# EAGLE schematic RPI_HAT_CDJ (EAGLE 8.2.2)
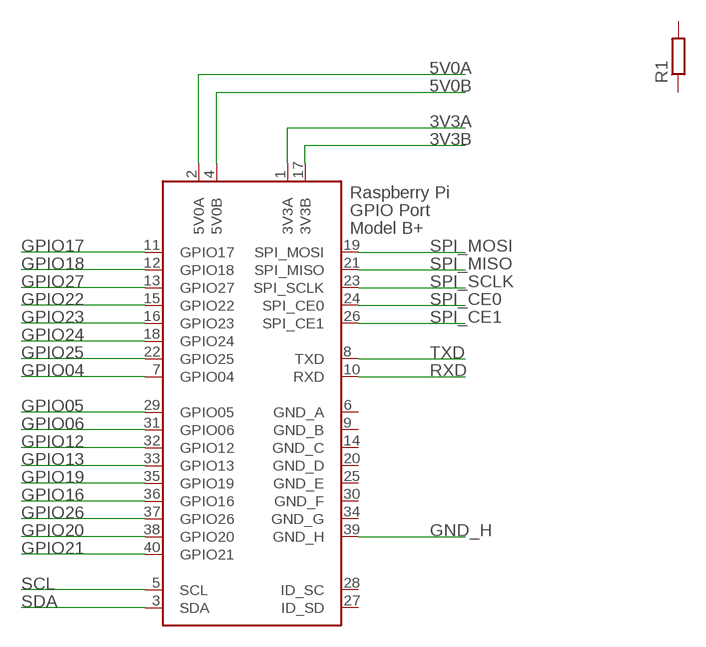
[diagram p0: schematic, sheet 1]

## Parts
R1  R-EU_M0805  [M0805]
X1  RASPI_BOARD_B+#_H  [RASPI_BOARD_B+HAT]

## Nets
3V3A: X1.1(3V3A)
3V3B: X1.17(3V3B)
5V0A: X1.2(5V0A)
5V0B: X1.4(5V0B)
GND_H: X1.39(GND_H)
GPIO04: X1.7(GPIO04)
GPIO05: X1.29(GPIO05)
GPIO06: X1.31(GPIO06)
GPIO12: X1.32(GPIO12)
GPIO13: X1.33(GPIO13)
GPIO16: X1.36(GPIO16)
GPIO17: X1.11(GPIO17)
GPIO18: X1.12(GPIO18)
GPIO19: X1.35(GPIO19)
GPIO20: X1.38(GPIO20)
GPIO21: X1.40(GPIO21)
GPIO22: X1.15(GPIO22)
GPIO23: X1.16(GPIO23)
GPIO24: X1.18(GPIO24)
GPIO25: X1.22(GPIO25)
GPIO26: X1.37(GPIO26)
GPIO27: X1.13(GPIO27)
RXD: X1.10(RXD)
SCL: X1.5(SCL)
SDA: X1.3(SDA)
SPI_CE0: X1.24(SPI_CE0)
SPI_CE1: X1.26(SPI_CE1)
SPI_MISO: X1.21(SPI_MISO)
SPI_MOSI: X1.19(SPI_MOSI)
SPI_SCLK: X1.23(SPI_SCLK)
TXD: X1.8(TXD)
Unconnected: R1.1 R1.2 X1.27(ID_SD) X1.28(ID_SC)

## Power pins joined to a net without a drawn wire
GND_A: X1.6(GND_A)
GND_B: X1.9(GND_B)
GND_C: X1.14(GND_C)
GND_D: X1.20(GND_D)
GND_E: X1.25(GND_E)
GND_F: X1.30(GND_F)
GND_G: X1.34(GND_G)

## Library data of the parts
R1 = rcl:R-EU_: RESISTOR, European symbol
X1 = raspberrypi_bastelstube_v13:RASPI_BOARD_B+#: Raspberry Pi GPIO connector with markings for the outer dimensions of the Raspberry Pi board model B+ with different sets of drill holes or mounting pads All pins connected